# Altium project _1986BE4 Dev Board.PrjPCB
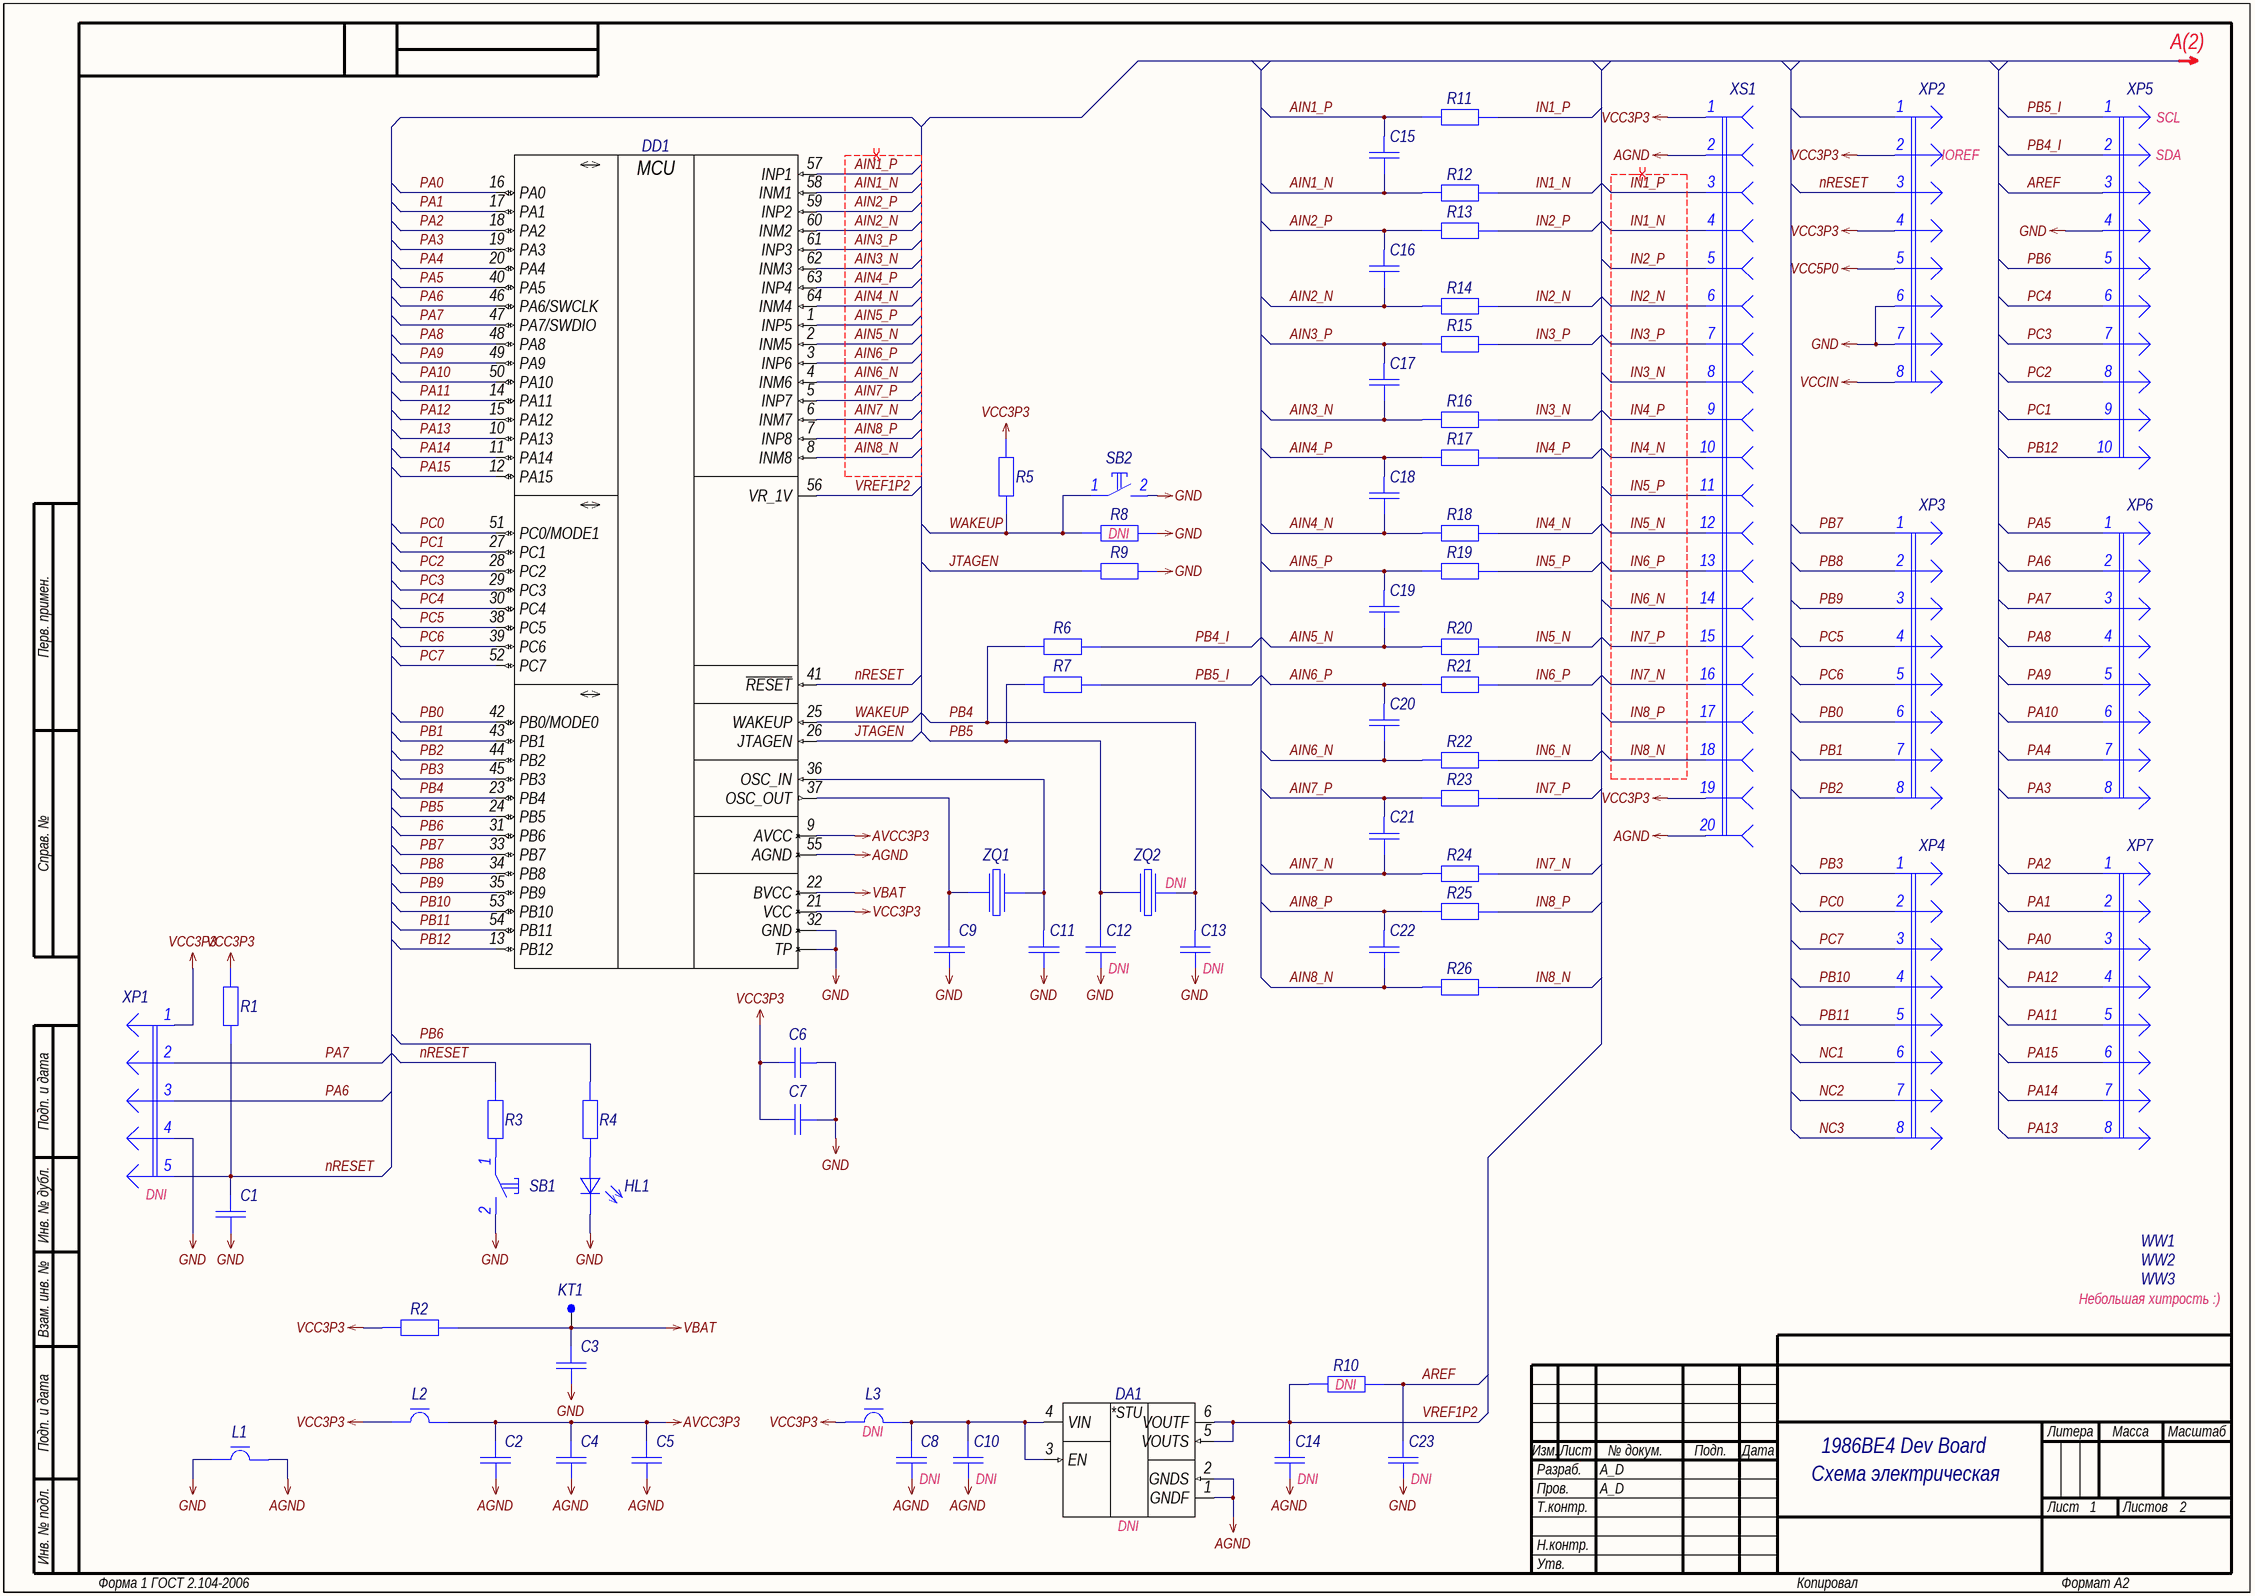
[diagram p0: 01_MAIN.SchDoc]
GlobalProjectRevision: 0; GlobalProjectNumber: A_D.000000.001; GlobalProjectName: 1986BE4 Dev Board; GlobalOrganizationName: A_D Electronics
2 sheets, 151 parts. Net scope: global (net labels, ports and power ports of the same name join across sheets).
Board file: BOARD.PcbDoc
Sheets:
  01_MAIN.SchDoc
  02_POWER.SchDoc

## Sheet 01_MAIN.SchDoc: =GlobalProjectName
size 594 x 420 mm; CheckedBy: A_D; Author: A_D; Organization: A_D Electronics; DocumentNumber: A_D.000000.001 Э3; Revision: 0; SheetNumber: 1; SheetTotal: 2; PageSetup: Record=PageOptions|CenterHorizontal=True|CenterVertical=True|PrintScale=0.70|XCorrection=1.00|YCorrection=1.00|PrintKind=2|BorderSize=5000000|LeftOffset=9000|BottomOffset=10100|Orientation=2|PaperLength=11176|PaperWidth=8636|Scale=100|PaperSource=259|PrintQuality=-3|MediaType=1|DitherType=10|PrintScaleMode=1|PaperKind=A3|PaperIndex=8; FirstApplication: A_D.000000.001; DocumentName: 1986BE4 Dev Board

### Parts
C1  Capacitor  [C0603_L]  (value not drawn)
C2  Capacitor  [C0603_L]  (value not drawn)
C3  Capacitor  [C0603_L]  (value not drawn)
C4  Capacitor  [C0603_L]  (value not drawn)
C5  Capacitor  [C0603_L]  (value not drawn)
C6  Capacitor  [C0603_L]  (value not drawn)
C7  Capacitor  [C0603_L]  (value not drawn)
C8  Capacitor  [C0603_L]  (value not drawn)  (no BOM)
C9  Capacitor  [C0603_L]  (value not drawn)
C10  Capacitor  [C0603_L]  (value not drawn)  (no BOM)
C11  Capacitor  [C0603_L]  (value not drawn)
C12  Capacitor  [C0603_L]  (value not drawn)  (no BOM)
C13  Capacitor  [C0603_L]  (value not drawn)  (no BOM)
C14  Capacitor  [C0603_L]  (value not drawn)  (no BOM)
C15  Capacitor  [C0603_L]  (value not drawn)
C16  Capacitor  [C0603_L]  (value not drawn)
C17  Capacitor  [C0603_L]  (value not drawn)
C18  Capacitor  [C0603_L]  (value not drawn)
C19  Capacitor  [C0603_L]  (value not drawn)
C20  Capacitor  [C0603_L]  (value not drawn)
C21  Capacitor  [C0603_L]  (value not drawn)
C22  Capacitor  [C0603_L]  (value not drawn)
C23  Capacitor  [C0603_L]  (value not drawn)  (no BOM)
DA1  ADR34xx-Series  [TSOT-23-6_095P290X160X100_N]  (value not drawn)  (no BOM)
DD1  1986ВЕ4У1-Series  [5153.64-1]  (value not drawn)
HL1  TEST  [LD0603_L]  (value not drawn)
KT1  VBAT  [TP-SMT-C-0.8mm]  (value not drawn)  (no BOM)
L1  FerriteBead  [L0805_L]  (value not drawn)
L2  FerriteBead  [L0603_L]  (value not drawn)
L3  FerriteBead  [L0603_L]  (value not drawn)  (no BOM)
R1  Resistor  [R0603_L]  (value not drawn)
R2  Resistor  [R0603_L]  (value not drawn)
R3  Resistor  [R0603_L]  (value not drawn)
R4  Resistor  [R0603_L]  (value not drawn)
R5  Resistor  [R0603_L]  (value not drawn)
R6  Resistor  [R0603_L]  (value not drawn)
R7  Resistor  [R0603_L]  (value not drawn)
R8  Resistor  [R0603_L]  (value not drawn)  (no BOM)
R9  Resistor  [R0603_L]  (value not drawn)
R10  Resistor  [R0603_L]  (value not drawn)  (no BOM)
R11  Resistor  [R0603_L]  (value not drawn)
R12  Resistor  [R0603_L]  (value not drawn)
R13  Resistor  [R0603_L]  (value not drawn)
R14  Resistor  [R0603_L]  (value not drawn)
R15  Resistor  [R0603_L]  (value not drawn)
R16  Resistor  [R0603_L]  (value not drawn)
R17  Resistor  [R0603_L]  (value not drawn)
R18  Resistor  [R0603_L]  (value not drawn)
R19  Resistor  [R0603_L]  (value not drawn)
R20  Resistor  [R0603_L]  (value not drawn)
R21  Resistor  [R0603_L]  (value not drawn)
R22  Resistor  [R0603_L]  (value not drawn)
R23  Resistor  [R0603_L]  (value not drawn)
R24  Resistor  [R0603_L]  (value not drawn)
R25  Resistor  [R0603_L]  (value not drawn)
R26  Resistor  [R0603_L]  (value not drawn)
SB1  СБРОС  [IT-1185AP]  (value not drawn)
SB2  WAKEUP  [IT-1185AP]  (value not drawn)
WW1  NoBody  [Mark-Fiducial_2.00mm]  (value not drawn)  (no BOM)
WW2  NoBody  [Mark-Fiducial_2.00mm]  (value not drawn)  (no BOM)
WW3  NoBody  [Mark-Fiducial_2.00mm]  (value not drawn)  (no BOM)
XP1  Prog  [PLS-5]  (value not drawn)  (no BOM)
XP2  Text  [PLS-8]  (value not drawn)
XP3  Text  [PLS-8]  (value not drawn)
XP4  Text  [PLS-8]  (value not drawn)
XP5  Text  [PLS-10]  (value not drawn)
XP6  Text  [PLS-8]  (value not drawn)
XP7  Text  [PLS-8]  (value not drawn)
XS1  ADC  [PBD-20]  (value not drawn)
ZQ1  Crystal  [SMD 5x3.2mm]  (value not drawn)
ZQ2  Crystal-1_4p  [DSO-N4]  (value not drawn)  (no BOM)

### Nets
AGND: C2.1 C4.1 C5.1 C8.1 C10.1 C14.1 DA1.1(GNDF) DA1.2(GNDS) DD1.55(AGND) L1.2 XS1.2 XS1.20
AVCC3P3: C2.2 C4.2 C5.2 DD1.9(AVCC) L2.2
GND: C1.1 C3.1 C6.1 C7.1 C9.1 C11.1 C12.1 C13.1 C23.1 DD1.32(GND) DD1.TP HL1.2(К) L1.1 R8.2 R9.2 SB1.2 SB2.2 XP1.4 XP2.6 XP2.7 XP5.4
VBAT: C3.2 DD1.22(BVCC) KT1.1 R2.2
VCC3P3: C6.2 C7.2 DD1.21(VCC) L2.1 L3.1 R1.2 R2.1 R5.2 XP1.1 XP2.2 XP2.4 XS1.1 XS1.19
VCC5P0: XP2.5
VCCIN: XP2.8
AIN1_N: C15.1 DD1.58(INM1) R12.1
AIN1_P: C15.2 DD1.57(INP1) R11.1
AIN2_N: C16.1 DD1.60(INM2) R14.1
AIN2_P: C16.2 DD1.59(INP2) R13.1
AIN3_N: C17.1 DD1.62(INM3) R16.1
AIN3_P: C17.2 DD1.61(INP3) R15.1
AIN4_N: C18.1 DD1.64(INM4) R18.1
AIN4_P: C18.2 DD1.63(INP4) R17.1
AIN5_N: C19.1 DD1.2(INM5) R20.1
AIN5_P: C19.2 DD1.1(INP5) R19.1
AIN6_N: C20.1 DD1.4(INM6) R22.1
AIN6_P: C20.2 DD1.3(INP6) R21.1
AIN7_N: C21.1 DD1.6(INM7) R24.1
AIN7_P: C21.2 DD1.5(INP7) R23.1
AIN8_N: C22.1 DD1.8(INM8) R26.1
AIN8_P: C22.2 DD1.7(INP8) R25.1
AREF: C23.2 R10.2 XP5.3
IN1_N: R12.2 XS1.4
IN1_P: R11.2 XS1.3
IN2_N: R14.2 XS1.6
IN2_P: R13.2 XS1.5
IN3_N: R16.2 XS1.8
IN3_P: R15.2 XS1.7
IN4_N: R18.2 XS1.10
IN4_P: R17.2 XS1.9
IN5_N: R20.2 XS1.12
IN5_P: R19.2 XS1.11
IN6_N: R22.2 XS1.14
IN6_P: R21.2 XS1.13
IN7_N: R24.2 XS1.16
IN7_P: R23.2 XS1.15
IN8_N: R26.2 XS1.18
IN8_P: R25.2 XS1.17
JTAGEN: DD1.26(JTAGEN) R9.1
NC1: XP4.6
NC2: XP4.7
NC3: XP4.8
nRESET: C1.2 DD1.41(~{RESET}) R1.1 R3.2 XP1.5 XP2.3
PA0: DD1.16(PA0) XP7.3
PA1: DD1.17(PA1) XP7.2
PA2: DD1.18(PA2) XP7.1
PA3: DD1.19(PA3) XP6.8
PA4: DD1.20(PA4) XP6.7
PA5: DD1.40(PA5) XP6.1
PA6: DD1.46(PA6/SWCLK) XP1.3 XP6.2
PA7: DD1.47(PA7/SWDIO) XP1.2 XP6.3
PA8: DD1.48(PA8) XP6.4
PA9: DD1.49(PA9) XP6.5
PA10: DD1.50(PA10) XP6.6
PA11: DD1.14(PA11) XP7.5
PA12: DD1.15(PA12) XP7.4
PA13: DD1.10(PA13) XP7.8
PA14: DD1.11(PA14) XP7.7
PA15: DD1.12(PA15) XP7.6
PB0: DD1.42(PB0/MODE0) XP3.6
PB1: DD1.43(PB1) XP3.7
PB2: DD1.44(PB2) XP3.8
PB3: DD1.45(PB3) XP4.1
PB4: C13.2 DD1.23(PB4) R6.1 ZQ2.1
PB4_I: R6.2 XP5.2
PB5: C12.2 DD1.24(PB5) R7.1 ZQ2.4
PB5_I: R7.2 XP5.1
PB6: DD1.31(PB6) R4.2 XP5.5
PB7: DD1.33(PB7) XP3.1
PB8: DD1.34(PB8) XP3.2
PB9: DD1.35(PB9) XP3.3
PB10: DD1.53(PB10) XP4.4
PB11: DD1.54(PB11) XP4.5
PB12: DD1.13(PB12) XP5.10
PC0: DD1.51(PC0/MODE1) XP4.2
PC1: DD1.27(PC1) XP5.9
PC2: DD1.28(PC2) XP5.8
PC3: DD1.29(PC3) XP5.7
PC4: DD1.30(PC4) XP5.6
PC5: DD1.38(PC5) XP3.4
PC6: DD1.39(PC6) XP3.5
PC7: DD1.52(PC7) XP4.3
VREF1P2: C14.2 DA1.5(VOUTS) DA1.6(VOUTF) DD1.56(VR_1V) R10.1
WAKEUP: DD1.25(WAKEUP) R5.1 R8.1 SB2.1
NetC8_2: C8.2 C10.2 DA1.3(EN) DA1.4(VIN) L3.2
NetC9_2: C9.2 DD1.37(OSC_OUT) ZQ1.1
NetC11_2: C11.2 DD1.36(OSC_IN) ZQ1.3
NetHL1_1: HL1.1(А) R4.1
NetR3_1: R3.1 SB1.1

Not connected (* = marked no-connect by the designer): XP2 1

### Layout directives
differential pair: AIN1_N, AIN1_P, AIN2_N, AIN2_P, AIN3_N, AIN3_P, AIN4_N, AIN4_P, AIN5_N, AIN5_P, AIN6_N, AIN6_P, AIN7_N, AIN7_P, AIN8_N, AIN8_P, IN1_N, IN1_P, IN2_N, IN2_P, IN3_N, IN3_P, IN4_N, IN4_P, IN5_N, IN5_P, IN6_N, IN6_P, IN7_N, IN7_P, IN8_N, IN8_P

### Notes on the sheet
- А(2)
- (near XP5) SCL
- (near XP2) IOREF
- (near XP5) SDA
- (near R8) DNI
- (near ZQ2) DNI
- (near C12) DNI
- (near C13) DNI
- (near XP1) DNI
- (near WW3) Небольшая хитрость :)
- (near R10) DNI
- (near L3) DNI
- (near C8) DNI
- (near C10) DNI
- (near C14) DNI
- (near C23) DNI
- Схема электрическая
  принципиальная
- (near DA1) DNI
- Перв. примен.
- Справ. №
- Подп. и дата
- Инв. № дубл.
- Взам. инв. №
- Разраб.
- Изм.
- Лист
- № докум.
- Подп.
- Дата
- Литера
- Масса
- Масштаб
- Пров.
- Т.контр.
- Листов
- Инв. № подл.
- Н.контр.
- Утв.
- Форма 1 ГОСТ 2.104-2006
- Копировал
- Формат А2
- (in symbol ADR3412ARJZ-R7) *STU
- (in symbol К1986ВЕ4У1К) MCU

### Library data of the parts
C1 C3 C4 C6 C10 C14 C23 = GRM188R72A104KA35D: Manufacturer: Murata; Type: Конденсатор; ID: 232; Value: 0.1uF; Voltage: 100V; Tolerance: ±10%; Dielectric Type: X7R; Application Category: 1; Working Temperature Min: -55°С; Working Temperature Max: +125°С; Published: 18.05.2010; Publisher: Andrew Danich; Part Number: GRM188R72A104KA35D; Footprint: 0603
C2 = GRM188R60J106ME47D: Manufacturer: Murata; Type: Конденсатор; ID: 136; Value: 10uF; Voltage: 6.3V; Tolerance: ±20%; Dielectric Type: X5R; Application Category: 1; Working Temperature Min: -55°С; Working Temperature Max: +85°С; Published: 18.05.2010; Publisher: Andrew Danich; Part Number: GRM188R60J106ME47D; Footprint: 0603
C5 = GCJ188R72A103KA01D: Manufacturer: Murata; Type: Конденсатор; ID: 130; Value: 0.01uF; Voltage: 100V; Tolerance: ±10%; Dielectric Type: X7R; Application Category: 1; Working Temperature Min: -55°С; Working Temperature Max: +125°С; Published: 18.05.2010; Publisher: Andrew Danich; Part Number: GCJ188R72A103KA01D; Footprint: 0603
C7 C8 = GCM188R71E105KA64D: Manufacturer: Murata; Type: Конденсатор; ID: 134; Value: 1uF; Voltage: 25V; Tolerance: ±10%; Dielectric Type: X7R; Application Category: 1; Working Temperature Min: -55°С; Working Temperature Max: +85°С; Published: 18.05.2010; Publisher: Andrew Danich; Part Number: GCM188R71E105KA64D; Footprint: 0603
C9 C11-C13 = GCM1885C2A120JA16D: Manufacturer: Murata; Type: Конденсатор; ID: 121; Value: 12pF; Voltage: 100V; Tolerance: ±5%; Dielectric Type: NP0; Application Category: 1; Working Temperature Min: -55°С; Working Temperature Max: +125°С; Published: 18.05.2010; Publisher: Andrew Danich; Part Number: GCM1885C2A120JA16D; Footprint: 0603
C15-C22 = GCM1885C2A101JA16D: Manufacturer: Murata; Type: Конденсатор; ID: 155; Value: 100pF; Voltage: 100V; Tolerance: ±5%; Dielectric Type: NP0; Application Category: 1; Working Temperature Min: -55°С; Working Temperature Max: +125°С; Published: 18.05.2010; Publisher: Andrew Danich; Part Number: GCM1885C2A101JA16D; Footprint: 0603
DA1 = ADR3412ARJZ-R7: Manufacturer: Analog Devices; ID: 18; Input Voltage: +2.3…5.5V; Output Current: 10mA; Output Voltage: +1.2V; Temperature Coefficient: 8ppm; Supply Current: 85uA; Application Category: 1; Working Temperature Min: -40°С; Working Temperature Max: +125°С; Functional Analog: ADR3412ARJZ-R2; Published: 01.10.2018; Publisher: Andrew Danich; Type: Микросхема; Part Number: ADR3412ARJZ-R7; Value: ADR3412ARJZ-R7
DD1 = К1986ВЕ4У1К: Manufacturer: Миландр; ID: 1; Supply Operation: +2.2…3.6V; Flash: 128Kb; SRAM: 16Kb; Prog Interface: SWD, JTAG; I/O Lines: 36; Operation Frequency: 36MHz; Specification: АЕЯР.431280.912 ТУ; Working Temperature Min: 0°С; Working Temperature Max: +70°С; Functional Analog: К1986ВЕ4У1, 1986ВЕ4У1; Published: 24.08.2018; Publisher: Andrew Danich; Type: Микросхема; Part Number: К1986ВЕ4У1К; Value: К1986ВЕ4У1К; EEPROM: -; Application Category: 1
HL1 = BL-LS0603DNB: Type: Индикатор единичный; ID: 12; Forward Voltage: 3.5V; Forward Current: 30mA; Power Dissipation: 78mW; Color: Blue; Leds: 1; Published: 03.12.2013; Publisher: Andrew Danich; Part Number: BL-LS0603DNB; Value: BL-LS0603DNB; Footprint: 0603; Application Category: 1
KT1 = TestPoint-SMT: ID: 6; Application Type: On PCB Test Point; Application Category: 1; Published: 03.03.2015; Publisher: Andrew Danich; Part Number: TestPoint-SMT; Value: TestPoint-SMT; Manufacturer: -; Functional Analog: -
L1 = BLM21PG331SN1: Manufacturer: Murata; Type: Дроссель; ID: 2; Rated Current: 1.5A; Impedance at 100Mhz: 330ohm; Tolerance: ±25%; DC Resistance: 0.07ohm; Inductor Type: EMIFIL; Application Category: 1; Working Temperature Min: -55°С; Working Temperature Max: +125°С; Published: 14.11.2014; Publisher: Andrew Danich; Part Number: BLM21PG331SN1; Value: BLM21PG331SN1; Footprint: 0805; ClassName: PolyDirectConnect
L2 L3 = BLM18PG331SN1: Manufacturer: Murata; Type: Дроссель; ID: 1; Rated Current: 1.2A; Impedance at 100Mhz: 330ohm; Tolerance: ±25%; DC Resistance: 0.15ohm; Inductor Type: EMIFIL; Working Temperature Min: -55°С; Working Temperature Max: +125°С; Published: 14.11.2014; Publisher: Andrew Danich; Part Number: BLM18PG331SN1; Value: BLM18PG331SN1; Footprint: 0603; Application Category: 1
R1 R5 = RC0603JR-0710KL: Manufacturer: Yageo; ID: 12; Value: 10k; Limit Voltage: 50V; Tolerance: ±5%; Temperature Coefficient: 100ppm; Total Power Dissipation: 0.1W; Series Type: Thick-Film; Application Category: 1; Working Temperature Min: -55°С; Working Temperature Max: +155°С; Functional Analog: CR0603-JW-103E; Published: 24.03.2010; Publisher: Andrew Danich; Type: Резистор; Part Number: RC0603JR-0710KL; Footprint: 0603
R2 R6-R10 = RC0603JR-070R: Manufacturer: Yageo; ID: 5; Value: 0; Limit Voltage: 50V; Tolerance: ±5%; Temperature Coefficient: 100ppm; Total Power Dissipation: 0.1W; Series Type: Thick-Film; Application Category: 1; Working Temperature Min: -55°С; Working Temperature Max: +155°С; Functional Analog: RC0603FR-070RL, CR0603-J/-000E; Published: 24.03.2010; Publisher: Andrew Danich; Type: Резистор; Part Number: RC0603JR-070R; Footprint: 0603
R3 = RC0603JR-07100R: Manufacturer: Yageo; ID: 10; Value: 100; Limit Voltage: 50V; Tolerance: ±5%; Temperature Coefficient: 100ppm; Total Power Dissipation: 0.1W; Series Type: Thick-Film; Application Category: 1; Working Temperature Min: -55°С; Working Temperature Max: +155°С; Functional Analog: CR0603-JW-101E; Published: 24.03.2010; Publisher: Andrew Danich; Type: Резистор; Part Number: RC0603JR-07100R; Footprint: 0603
R4 = RC0603JR-07330RL: Manufacturer: Yageo; ID: 313; Value: 330; Limit Voltage: 50V; Tolerance: ±5%; Temperature Coefficient: 100ppm; Total Power Dissipation: 0.1W; Series Type: Thick-Film; Application Category: 1; Working Temperature Min: -55°С; Working Temperature Max: +155°С; Functional Analog: CR0603-JW-331E; Published: 24.03.2010; Publisher: Andrew Danich; Type: Резистор; Part Number: RC0603JR-07330RL; Footprint: 0603
R11-R26 = RC0603FR-0749R9L: Manufacturer: Yageo; ID: 249; Value: 49.9; Limit Voltage: 50V; Tolerance: ±1%; Temperature Coefficient: 100ppm; Total Power Dissipation: 0.1W; Series Type: Thick-Film; Application Category: 1; Working Temperature Min: -55°С; Working Temperature Max: +155°С; Functional Analog: CR0603-FX-49R9E; Published: 24.03.2010; Publisher: Andrew Danich; Type: Резистор; Part Number: RC0603FR-0749R9L; Footprint: 0603
SB1 SB2 = IT-1185AP: ID: 36; Limit Current: 50mA; Resistance: 0.1ohm; Isolator Resistance: 100meg; Backlight: NO; Number of Contacts: 2; Application Category: 1; Published: 17.04.2014; Publisher: Andrew Danich; Type: Переключатель; Part Number: IT-1185AP; Value: IT-1185AP; Height: 5mm
WW1-WW3 = MARK_FIDUCIAL: ID: 3; Published: 24.03.2015; Publisher: Andrew Danich; Type: Лепесток; Part Number: MARK_FIDUCIAL; Value: MARK_FIDUCIAL
XP1 = PLS-5: Value: PLS-5; ID: 4; Limit Voltage: 250V; Limit Current: 3A; Connector Type: Male; Resistance: 15momh; Surface Finish: Gold; Pitch: 2.54mm; Application Category: 1; Published: 07.03.2013; Publisher: Andrew Danich; Type: Вилка; Part Number: PLS-5; Pins: 5
XP2-XP4 XP6 XP7 = PLS-8: Value: PLS-8; ID: 7; Limit Voltage: 250V; Limit Current: 3A; Connector Type: Male; Resistance: 15momh; Surface Finish: Gold; Pitch: 2.54mm; Application Category: 1; Published: 07.03.2013; Publisher: Andrew Danich; Type: Вилка; Part Number: PLS-8; Pins: 8
XP5 = PLS-10: Value: PLS-10; ID: 9; Limit Voltage: 250V; Limit Current: 3A; Connector Type: Male; Resistance: 15momh; Surface Finish: Gold; Pitch: 2.54mm; Application Category: 1; Published: 07.03.2013; Publisher: Andrew Danich; Type: Вилка; Part Number: PLS-10; Pins: 10
XS1 = PBD-20: Value: PBD-20; ID: 24; Limit Voltage: 250V; Limit Current: 3A; Connector Type: Female; Resistance: 15momh; Surface Finish: Gold; Pitch: 2.54mm; Application Category: 1; Published: 07.03.2013; Publisher: Andrew Danich; Type: Розетка; Part Number: PBD-20; Pins: 20
ZQ1 = AB-16.000MAGE-T: ID: 13; Output Frequency: 16MHz; Load Capacitance: 12pF; Application Category: 1; Published: 08.03.2013; Publisher: Andrew Danich; Type: Резонатор; Part Number: AB-16.000MAGE-T; Value: AB-16.000MAGE-T
ZQ2 = MC306-32.768KHz: Manufacturer: Seiko Epson Corporation; ID: 11; Shunt Capacitance: 0.9pF; Load Capacitance: 12.5pF; Application Category: 1; Working Temperature Min: -40°С; Working Temperature Max: +85°С; Published: 12.09.2014; Publisher: Andrew Danich; Type: Резонатор; Part Number: MC306-32.768KHz; Value: MC306-32.768KHz; Output Frequency: 32.768KHz; Functional Analog: -

## Sheet 02_POWER.SchDoc: =GlobalProjectName
size 594 x 420 mm; CheckedBy: A_D; Author: A_D; Organization: A_D Electronics; DocumentNumber: A_D.000000.001 Э3; Revision: 0; SheetNumber: 2; SheetTotal: 2; PageSetup: Record=PageOptions|CenterHorizontal=True|CenterVertical=True|PrintScale=0.70|XCorrection=1.00|YCorrection=1.00|PrintKind=2|BorderSize=5000000|LeftOffset=9000|BottomOffset=10100|Orientation=2|PaperLength=11176|PaperWidth=8636|Scale=100|PaperSource=259|PrintQuality=-3|MediaType=1|DitherType=10|PrintScaleMode=1|PaperKind=A3|PaperIndex=8; FirstApplication: A_D.000000.001; DocumentName: 1986BE4 Dev Board
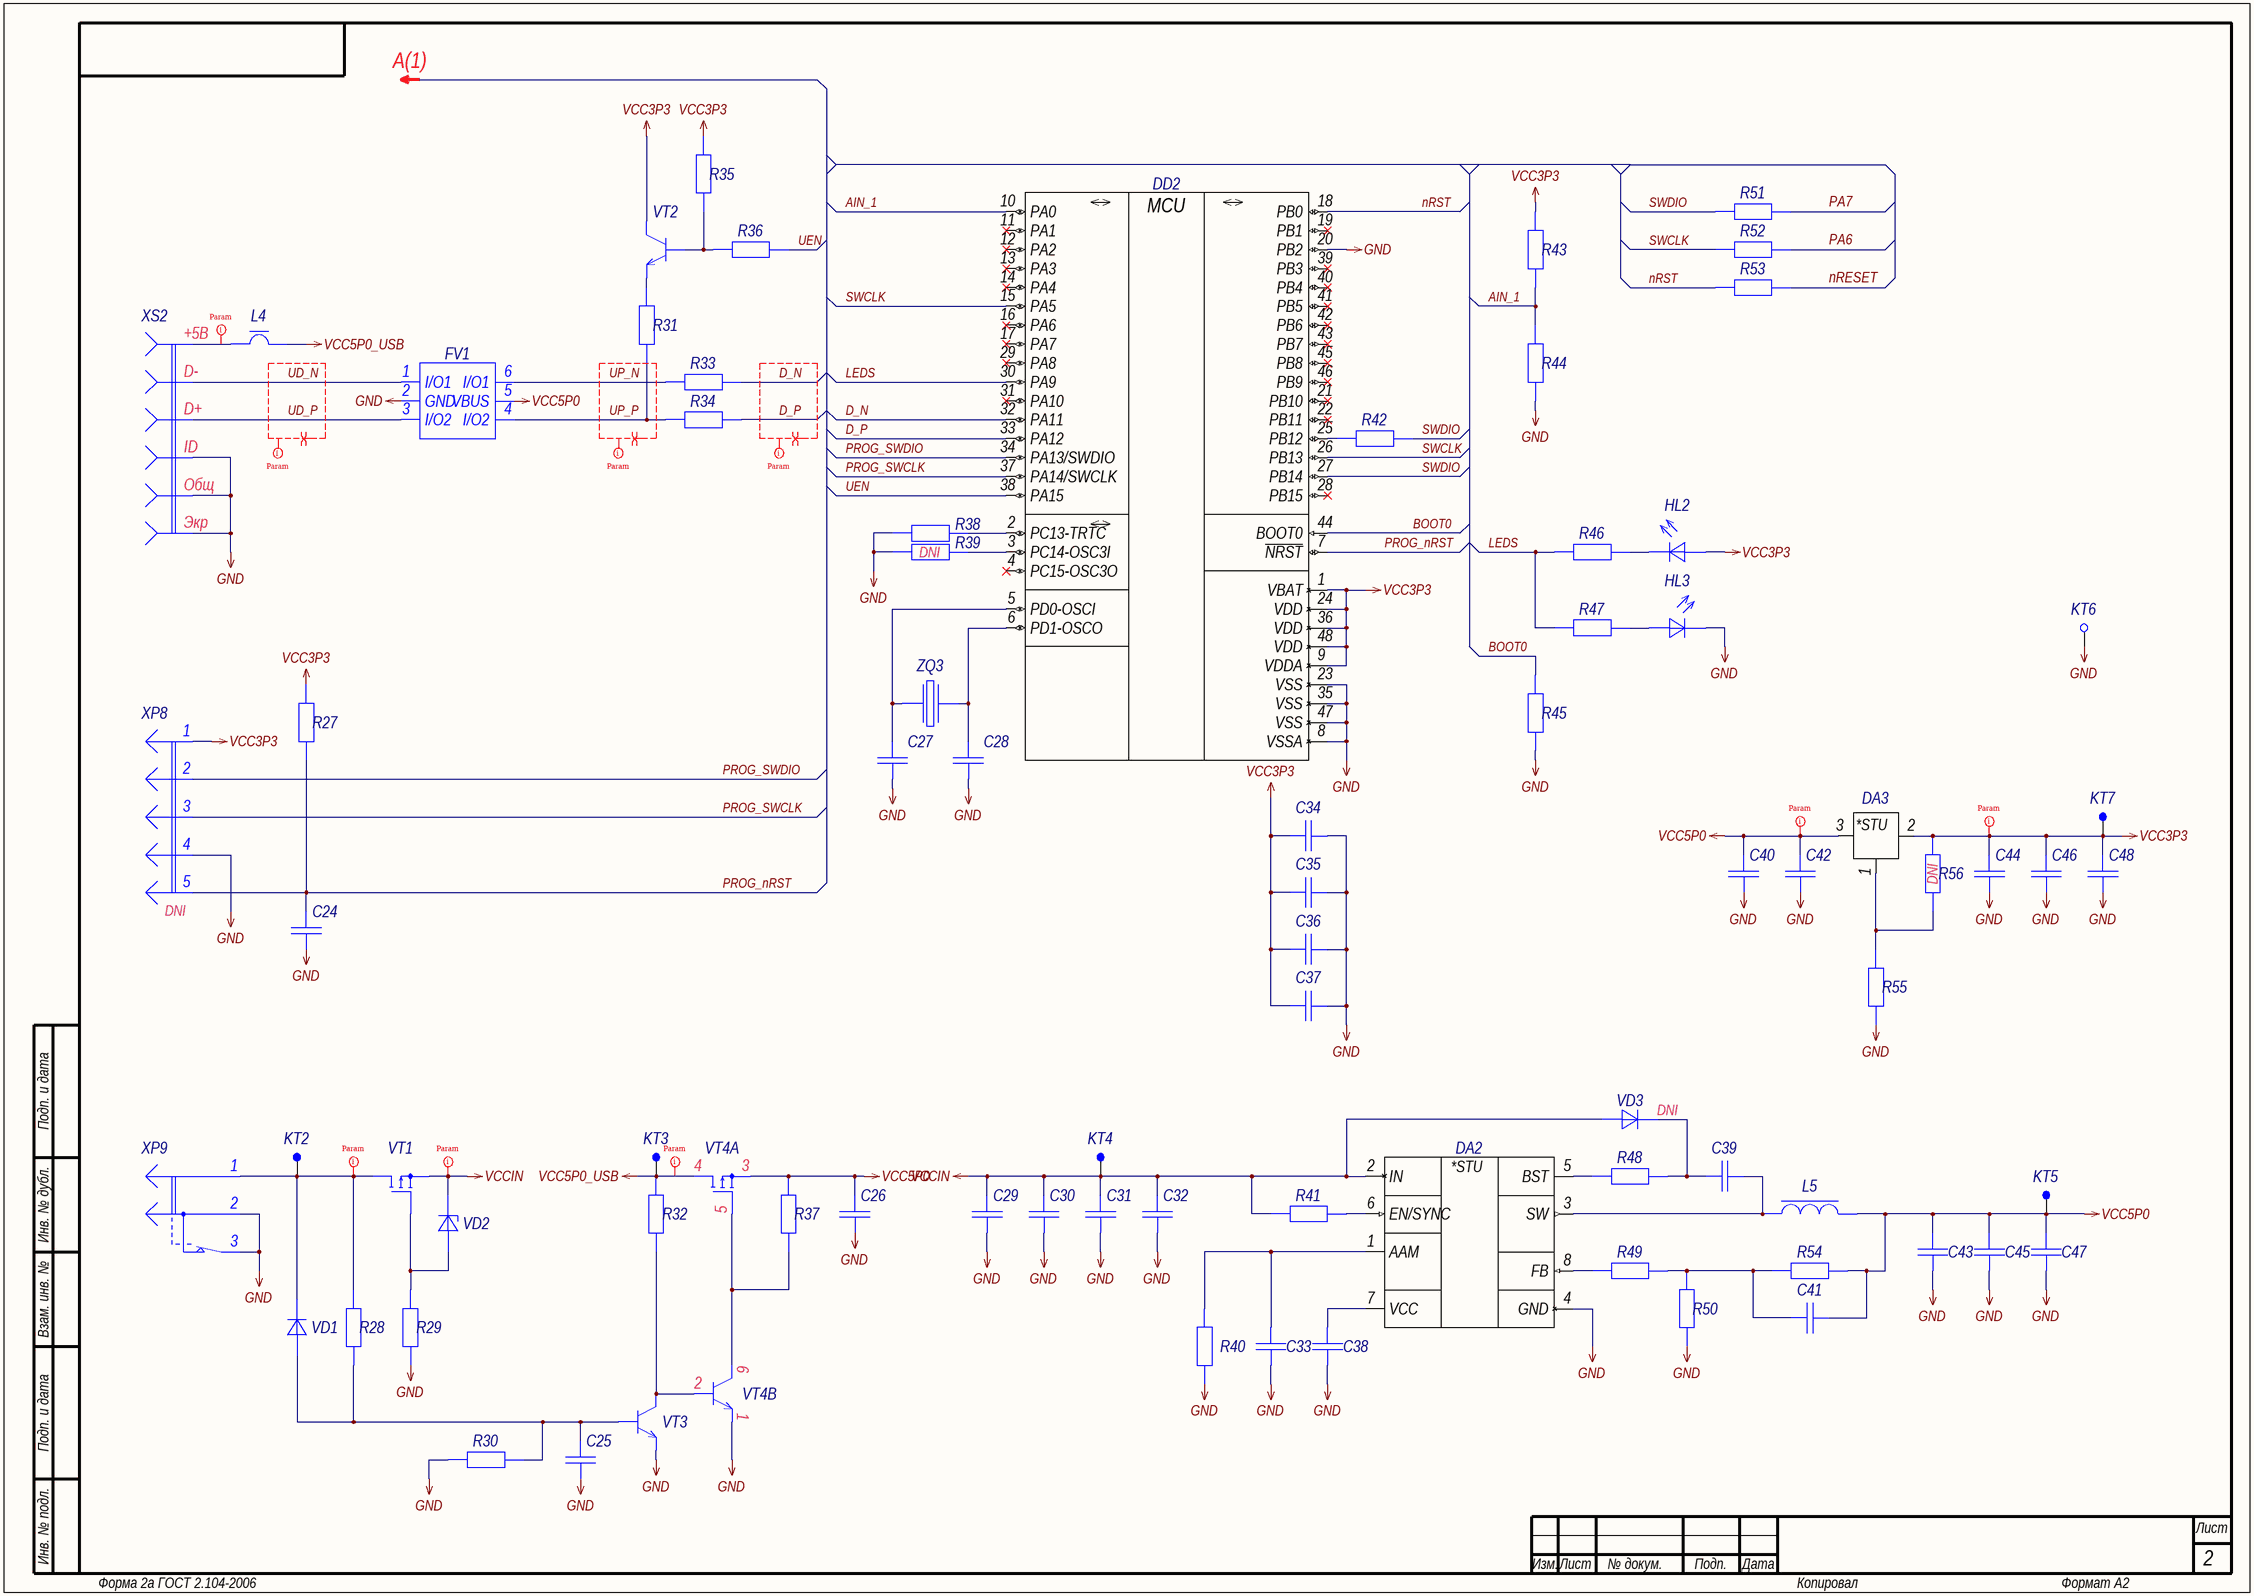
[diagram p1: 02_POWER.SchDoc]

### Parts
C24  Capacitor  [C0603_L]  (value not drawn)
C25  Capacitor  [C0603_L]  (value not drawn)
C26  Capacitor  [C0805_L]  (value not drawn)
C27  Capacitor  [C0603_L]  (value not drawn)
C28  Capacitor  [C0603_L]  (value not drawn)
C29  Capacitor  [C1206_L]  (value not drawn)
C30  Capacitor  [C1206_L]  (value not drawn)
C31  Capacitor  [C1206_L]  (value not drawn)
C32  Capacitor  [C0603_L]  (value not drawn)
C33  Capacitor  [C0603_L]  (value not drawn)
C34  Capacitor  [C0603_L]  (value not drawn)
C35  Capacitor  [C0603_L]  (value not drawn)
C36  Capacitor  [C0603_L]  (value not drawn)
C37  Capacitor  [C0603_L]  (value not drawn)
C38  Capacitor  [C0603_L]  (value not drawn)
C39  Capacitor  [C0603_L]  (value not drawn)
C40  Capacitor  [C0805_L]  (value not drawn)
C41  Capacitor  [C0603_L]  (value not drawn)
C42  Capacitor  [C0603_L]  (value not drawn)
C43  Capacitor  [C0805_L]  (value not drawn)
C44  Capacitor  [C0603_L]  (value not drawn)
C45  Capacitor  [C0805_L]  (value not drawn)
C46  Capacitor  [C0805_L]  (value not drawn)
C47  Capacitor  [C0805_L]  (value not drawn)
C48  Capacitor  [C0805_L]  (value not drawn)
DA2  MP2315GJ  [TSOT-23-8_065P290X160X100_N]  (value not drawn)
DA3  LM1117-Series  [SOT-223_230P650X350X180_N]  (value not drawn)
DD2  STM32F103Cxxx-Series  [LQFP-48_050P700X700X160_N]  (value not drawn)
FV1  USBLC6-2SC6  [SOT-23-6_095P290X160X145_N]  (value not drawn)
HL2  Text  [LD0603_L]  (value not drawn)
HL3  Text  [LD0603_L]  (value not drawn)
KT2  VCCIN  [TP-SMT-C-0.8mm]  (value not drawn)  (no BOM)
KT3  VBUS  [TP-SMT-C-0.8mm]  (value not drawn)  (no BOM)
KT4  VCCIN  [TP-SMT-C-0.8mm]  (value not drawn)  (no BOM)
KT5  +5V  [TP-SMT-C-0.8mm]  (value not drawn)  (no BOM)
KT6  ОБЩ  [5001]  (value not drawn)  (no BOM)
KT7  +3.3V  [TP-SMT-C-0.8mm]  (value not drawn)  (no BOM)
L4  FerriteBead  [L0603_L]  (value not drawn)
L5  Coil  [SRP5030T-Series]  (value not drawn)
R27  Resistor  [R0603_L]  (value not drawn)
R28  Resistor  [R0603_L]  (value not drawn)
R29  Resistor  [R0603_L]  (value not drawn)
R30  Resistor  [R0603_L]  (value not drawn)
R31  Resistor  [R0603_L]  (value not drawn)
R32  Resistor  [R0603_L]  (value not drawn)
R33  Resistor  [R0603_L]  (value not drawn)
R34  Resistor  [R0603_L]  (value not drawn)
R35  Resistor  [R0603_L]  (value not drawn)
R36  Resistor  [R0603_L]  (value not drawn)
R37  Resistor  [R0603_L]  (value not drawn)
R38  Resistor  [R0603_L]  (value not drawn)
R39  Resistor  [R0603_L]  (value not drawn)  (no BOM)
R40  Resistor  [R0603_L]  (value not drawn)
R41  Resistor  [R0603_L]  (value not drawn)
R42  Resistor  [R0603_L]  (value not drawn)
R43  Resistor  [R0603_L]  (value not drawn)
R44  Resistor  [R0603_L]  (value not drawn)
R45  Resistor  [R0603_L]  (value not drawn)
R46  Resistor  [R0603_L]  (value not drawn)
R47  Resistor  [R0603_L]  (value not drawn)
R48  Resistor  [R0603_L]  (value not drawn)
R49  Resistor  [R0603_L]  (value not drawn)
R50  Resistor  [R0603_L]  (value not drawn)
R51  Resistor  [R0603_L]  (value not drawn)
R52  Resistor  [R0603_L]  (value not drawn)
R53  Resistor  [R0603_L]  (value not drawn)
R54  Resistor  [R0603_L]  (value not drawn)
R55  Resistor  [R0603_L]  (value not drawn)
R56  Resistor  [R0603_L]  (value not drawn)  (no BOM)
VD1  Diode  [SOD-323]  (value not drawn)
VD2  Zener  [SOD-323]  (value not drawn)
VD3  Diode  [SOD-323]  (value not drawn)  (no BOM)
VT1  MOSFET-P  [SOT-23_190P290X160X145_N]  (value not drawn)
VT2  BJT-NPN  [SOT-23_190P290X160X145_N]  (value not drawn)
VT3  BJT-NPN  [SOT-23_190P290X160X145_N]  (value not drawn)
VT4  PMC85XP  [SOT-1118-2M_065P200X200X065_N]  (value not drawn)  (parts A,B of 2)
XP8  Prog  [PLS-5]  (value not drawn)  (no BOM)
XP9  DC  [DJK-02-Series]  (value not drawn)
XS2  J-Link  [1981568-1]  (value not drawn)
ZQ3  Crystal  [SMD 5x3.2mm]  (value not drawn)

### Nets
GND: C24.1 C25.1 C26.1 C27.1 C28.1 C29.1 C30.1 C31.1 C32.1 C33.1 C34.1 C35.1 C36.1 C37.1 C38.1 C40.1 C42.1 C43.1 C44.1 C45.1 C46.1 C47.1 C48.1 DA2.4(GND) DD2.8(VSSA) DD2.20(PB2) DD2.23(VSS) DD2.35(VSS) DD2.47(VSS) FV1.2(GND) HL3.2(К) KT6.1 R29.1 R30.2 R38.2 R39.2 R40.1 R44.1 R45.1 R50.1 R55.1 VT3.3(Э) VT4.1(Э) XP8.4 XP9.2 XP9.3 XS2.4 XS2.5 XS2.6
VCC3P3: C34.2 C35.2 C36.2 C37.2 C44.2 C46.2 C48.2 DA3.2(Out) DD2.1(VBAT) DD2.9(VDDA) DD2.24(VDD) DD2.36(VDD) DD2.48(VDD) HL2.1(А) KT7.1 R27.2 R35.2 R43.2 R56.2 VT2.2(К) XP8.1
VCC5P0: C26.2 C40.2 C41.2 C42.2 C43.2 C45.2 C47.2 DA3.3(In) FV1.5(VBUS) KT5.1 L5.2 R37.2 R54.2 VT4.3(S)
VCC5P0_USB: KT3.1 L4.2 R32.2 VT4.4(D)
VCCIN: C29.2 C30.2 C31.2 C32.2 DA2.2(IN) KT4.1 R41.1 VD2.2(К) VD3.1(А) VT1.3(S)
AIN_1: DD2.10(PA0) R43.1 R44.2
BOOT0: DD2.44(BOOT0) R45.2
D_N: DD2.32(PA11) R33.2
D_P: DD2.33(PA12) R34.2
LEDS: DD2.30(PA9) R46.1 R47.1
nRESET: R53.2
nRST: DD2.18(PB0) R53.1
PA6: R52.2
PA7: R51.2
PROG_nRST: C24.2 DD2.7(~{NRST}) R27.1 XP8.5
PROG_SWCLK: DD2.37(PA14/SWCLK) XP8.3
PROG_SWDIO: DD2.34(PA13/SWDIO) XP8.2
SWCLK: DD2.15(PA5) DD2.26(PB13) R52.1
SWDIO: DD2.27(PB14) R42.2 R51.1
UD_N: FV1.1(I/O1) XS2.2
UD_P: FV1.3(I/O2) XS2.3
UEN: DD2.38(PA15) R36.2
UP_N: FV1.6(I/O1) R33.1
UP_P: FV1.4(I/O2) R31.1 R34.1
NetC25_2: C25.2 R28.1 R30.1 VD1.1(А) VT3.1(Б)
NetC27_2: C27.2 DD2.5(PD0-OSCI) ZQ3.3
NetC28_2: C28.2 DD2.6(PD1-OSCO) ZQ3.1
NetC33_2: C33.2 DA2.1(AAM) R40.2
NetC38_2: C38.2 DA2.7(VCC)
NetC39_1: C39.1 R48.2 VD3.2(К)
NetC39_2: C39.2 DA2.3(SW) L5.1
NetC41_1: C41.1 R49.2 R50.2 R54.1
NetDA2_5: DA2.5(BST) R48.1
NetDA2_6: DA2.6(EN/SYNC) R41.2
NetDA2_8: DA2.8(FB) R49.1
NetDA3_1: DA3.1(Adj/GND) R55.2 R56.1
NetDD2_2: DD2.2(PC13-TRTC) R38.1
NetDD2_3: DD2.3(PC14-OSC3I) R39.1
NetDD2_25: DD2.25(PB12) R42.1
NetHL2_2: HL2.2(К) R46.2
NetHL3_1: HL3.1(А) R47.2
NetKT2_1: KT2.1 R28.2 VD1.2(К) VT1.2(D) XP9.1
NetL4_1: L4.1 XS2.1
NetR29_2: R29.2 VD2.1(А) VT1.1(G)
NetR31_2: R31.2 VT2.3(Э)
NetR32_1: R32.1 VT3.2(К) VT4.2(Б)
NetR35_1: R35.1 R36.1 VT2.1(Б)
NetR37_1: R37.1 VT4.5(G) VT4.6(К)

Not connected (* = marked no-connect by the designer): DD2 4(PC15-OSC3O)* 11(PA1)* 12(PA2)* 13(PA3)* 14(PA4)* 16(PA6)* 17(PA7)* 19(PB1)* 21(PB10)* 22(PB11)* 28(PB15)* 29(PA8)* 31(PA10)* 39(PB3)* 40(PB4)* 41(PB5)* 42(PB6)* 43(PB7)* 45(PB8)* 46(PB9)*

### Layout directives
differential pair: D_N, D_P, UD_N, UD_P, UP_N, UP_P
rule Matched Net Lengths [Tolerance = 1mm]: D_N, D_P, UD_N, UD_P, UP_N, UP_P
rule Polygon Connect Style [Style - Direct Connect]: NetKT2_1, NetL4_1, VCC3P3, VCC5P0, VCC5P0_USB, VCCIN

### Notes on the sheet
- А(1)
- (near R39) DNI
- (near R56) DNI
- (near XP8) DNI
- (near VD3) DNI
- Подп. и дата
- Инв. № дубл.
- Взам. инв. №
- Инв. № подл.
- Изм.
- Лист
- № докум.
- Подп.
- Дата
- Форма 2а ГОСТ 2.104-2006
- Копировал
- Формат А2
- (in symbol 1981568-1) +5В; D-; D+; ID; Общ; Экр
- (in symbol LM1117MPX-3.3) *STU
- (in symbol MP2315GJ-Z) *STU
- (in symbol STM32F103C8T6) MCU

### Library data of the parts
C24 C25 C32 C34-C39 C42 C44 = GRM188R72A104KA35D: as C1 on sheet 01_MAIN; Published: 18.05.2010; Publisher: Andrew Danich; Part Number: GRM188R72A104KA35D; Footprint: 0603
  C32 C39: ClassName: PolyDirectConnect
C26 C40 C43 C45-C48 = GRM21BR60J226ME39L: Manufacturer: Murata; Type: Конденсатор; ID: 140; Value: 22uF; Voltage: 6.3V; Tolerance: ±20%; Dielectric Type: X5R; Application Category: 1; Working Temperature Min: -55°С; Working Temperature Max: +85°С; Published: 18.05.2010; Publisher: Andrew Danich; Part Number: GRM21BR60J226ME39L; Footprint: 0805; ClassName: PolyDirectConnect
C27 C28 = GCM1885C1H150JA16D: Manufacturer: Murata; Type: Конденсатор; ID: 214; Value: 15pF; Voltage: 50V; Tolerance: ±5%; Dielectric Type: NP0; Application Category: 1; Working Temperature Min: -55°С; Working Temperature Max: +125°С; Published: 18.05.2010; Publisher: Andrew Danich; Part Number: GCM1885C1H150JA16D; Footprint: 0603
C29-C31 = GRM31CR71A226KE15L: Manufacturer: Murata; Type: Конденсатор; ID: 238; Value: 22uF; Voltage: 10V; Tolerance: ±10%; Dielectric Type: X7R; Application Category: 1; Working Temperature Min: -55°С; Working Temperature Max: +125°С; Published: 18.05.2010; Publisher: Andrew Danich; Part Number: GRM31CR71A226KE15L; Footprint: 1206; ClassName: PolyDirectConnect
C33 = GRM1885C2A102JA01D: Manufacturer: Murata; Type: Конденсатор; ID: 135; Value: 1000pF; Voltage: 100V; Tolerance: ±5%; Dielectric Type: NP0; Application Category: 1; Working Temperature Min: -55°С; Working Temperature Max: +125°С; Published: 18.05.2010; Publisher: Andrew Danich; Part Number: GRM1885C2A102JA01D; Footprint: 0603
C41 = GRM1885C1H330JA01D: Manufacturer: Murata; Type: Конденсатор; ID: 123; Value: 33pF; Voltage: 50V; Tolerance: ±5%; Dielectric Type: NP0; Application Category: 1; Working Temperature Min: -55°С; Working Temperature Max: +125°С; Published: 18.05.2010; Publisher: Andrew Danich; Part Number: GRM1885C1H330JA01D; Footprint: 0603
DA2 = MP2315GJ-Z: Manufacturer: Monolithic Power Systems; ID: 38; Input Voltage: +4.5…24V; Output Current: 3A; Output Voltage: +0.8…22.8V; Shutdown Input: YES; Frequency: 500kHz; Application Category: 1; Working Temperature Min: -40°С; Working Temperature Max: +125°С; Functional Analog: MP2315GJ-P; Type: Микросхема; Published: 01.09.2018; Publisher: Andrew Danich; Part Number: MP2315GJ-Z; Value: MP2315GJ-Z; ClassName: PolyDirectConnect
DA3 = LM1117MPX-3.3: ID: 9; Input Voltage: +8.5…20V; Output Current: 800mA; Output Voltage: +3.3V; Application Category: 1; Published: 13.08.2015; Publisher: Andrew Danich; Type: Микросхема; Part Number: LM1117MPX-3.3; Value: LM1117MPX-3.3; ClassName: PolyDirectConnect
DD2 = STM32F103C8T6: Manufacturer: STMicroelectronics; ID: 20; Supply Operation: +2.0…3.6V; Flash: 64K; SRAM: 20K; Prog Interface: JTAG, SWD, UART; I/O Lines: 37; Operation Frequency: 72MHz; Application Category: 1; Working Temperature Min: -40°С; Working Temperature Max: +85°С; Published: 16.10.2015; Publisher: Andrew Danich; Type: Микросхема; Part Number: STM32F103C8T6; Value: STM32F103C8T6; EEPROM: -
FV1 = USBLC6-2SC6: Manufacturer: STMicroelectronics; ID: 11; Breakdown Voltage: 6V; Reverse Stand Off Voltage: 17V; Forward Voltage: 0.95V; Peak Forward Current: 5A; Junction Capacitance: 2.5pF; Directional: Bidirectional; Application Category: 1; Working Temperature Min: -40°С; Working Temperature Max: +125°С; Published: 21.02.2017; Publisher: Andrew Danich; Type: Супрессор; Part Number: USBLC6-2SC6; Value: USBLC6-2SC6; Functional Analog: -
HL2 = BL-LS0603GC: Type: Индикатор единичный; ID: 14; Forward Voltage: 2.3V; Forward Current: 30mA; Power Dissipation: 65mW; Color: Green; Leds: 1; Published: 03.12.2013; Publisher: Andrew Danich; Part Number: BL-LS0603GC; Value: BL-LS0603GC; Footprint: 0603; Application Category: 1
HL3 = BL-LS0603HC: Type: Индикатор единичный; ID: 13; Forward Voltage: 2.2V; Forward Current: 30mA; Power Dissipation: 65mW; Color: Red; Leds: 1; Published: 03.12.2013; Publisher: Andrew Danich; Part Number: BL-LS0603HC; Value: BL-LS0603HC; Footprint: 0603; Application Category: 1
KT2-KT5 KT7 = TestPoint-SMT: as KT1 on sheet 01_MAIN; Published: 03.03.2015; Publisher: Andrew Danich; Part Number: TestPoint-SMT; Value: TestPoint-SMT; Manufacturer: -; Functional Analog: -
KT6 = 5001: Manufacturer: Keystone Electronics; ID: 2; Value: 5001; Limit Voltage: 100V; Rated Current: 0.5A; Application Type: Miniature THM Test Point; Application Category: 1; Published: 03.03.2015; Publisher: Andrew Danich; Part Number: 5001; Functional Analog: -
L4 = BLM18PG331SN1: as L2 on sheet 01_MAIN; Published: 14.11.2014; Publisher: Andrew Danich; Part Number: BLM18PG331SN1; Value: BLM18PG331SN1; Footprint: 0603; Application Category: 1
L5 = SRP5030T-4R7M: Manufacturer: Bourns; Type: Дроссель; ID: 78; Rated Current: 4.6A; Tolerance: ±20%; Inductance: 4.7uH; DC Resistance: 0.053ohm; Application Category: 1; Working Temperature Min: -40°С; Working Temperature Max: +125°С; Published: 20.05.2010; Publisher: Andrew Danich; Part Number: SRP5030T-4R7M; Value: SRP5030T-4R7M; Footprint: SRP5030T; ClassName: PolyDirectConnect
R27-R30 R32 R37-R39 R45 = RC0603JR-0710KL: as R1 on sheet 01_MAIN; Published: 24.03.2010; Publisher: Andrew Danich; Type: Резистор; Part Number: RC0603JR-0710KL; Footprint: 0603
R31 = RC0603JR-071K5L: Manufacturer: Yageo; ID: 8; Value: 1.5k; Limit Voltage: 50V; Tolerance: ±5%; Temperature Coefficient: 100ppm; Total Power Dissipation: 0.1W; Series Type: Thick-Film; Application Category: 1; Working Temperature Min: -55°С; Working Temperature Max: +155°С; Published: 24.03.2010; Publisher: Andrew Danich; Type: Резистор; Part Number: RC0603JR-071K5L; Footprint: 0603
R33 R34 R51-R53 = RC0603JR-0722RL: Manufacturer: Yageo; ID: 29; Value: 22; Limit Voltage: 50V; Tolerance: ±5%; Temperature Coefficient: 100ppm; Total Power Dissipation: 0.1W; Series Type: Thick-Film; Application Category: 1; Working Temperature Min: -55°С; Working Temperature Max: +155°С; Published: 24.03.2010; Publisher: Andrew Danich; Type: Резистор; Part Number: RC0603JR-0722RL; Footprint: 0603
R35 R43 R44 = RC0603JR-074K7L: Manufacturer: Yageo; ID: 56; Value: 4.7k; Limit Voltage: 50V; Tolerance: ±5%; Temperature Coefficient: 100ppm; Total Power Dissipation: 0.1W; Series Type: Thick-Film; Application Category: 1; Working Temperature Min: -55°С; Working Temperature Max: +155°С; Published: 24.03.2010; Publisher: Andrew Danich; Type: Резистор; Part Number: RC0603JR-074K7L; Footprint: 0603
R36 R42 = RC0603JR-07100R: as R3 on sheet 01_MAIN; Published: 24.03.2010; Publisher: Andrew Danich; Type: Резистор; Part Number: RC0603JR-07100R; Footprint: 0603
R40 = RC0603FR-0763K4L: Manufacturer: Yageo; ID: 468; Value: 63.4k; Limit Voltage: 50V; Tolerance: ±1%; Temperature Coefficient: 100ppm; Total Power Dissipation: 0.1W; Series Type: Thick-Film; Application Category: 1; Working Temperature Min: -55°С; Working Temperature Max: +155°С; Published: 24.03.2010; Publisher: Andrew Danich; Type: Резистор; Part Number: RC0603FR-0763K4L; Footprint: 0603
R41 = RC0603JR-07100KL: Manufacturer: Yageo; ID: 11; Value: 100k; Limit Voltage: 50V; Tolerance: ±5%; Temperature Coefficient: 100ppm; Total Power Dissipation: 0.1W; Series Type: Thick-Film; Application Category: 1; Working Temperature Min: -55°С; Working Temperature Max: +155°С; Functional Analog: CR0603-JW-104E; Published: 24.03.2010; Publisher: Andrew Danich; Type: Резистор; Part Number: RC0603JR-07100KL; Footprint: 0603
R46 R47 = RC0603JR-07330RL: as R4 on sheet 01_MAIN; Published: 24.03.2010; Publisher: Andrew Danich; Type: Резистор; Part Number: RC0603JR-07330RL; Footprint: 0603
R48 = RC0603JR-0720RL: Manufacturer: Yageo; ID: 469; Value: 20; Limit Voltage: 50V; Tolerance: ±5%; Temperature Coefficient: 100ppm; Total Power Dissipation: 0.1W; Series Type: Thick-Film; Application Category: 1; Working Temperature Min: -55°С; Working Temperature Max: +155°С; Published: 24.03.2010; Publisher: Andrew Danich; Type: Резистор; Part Number: RC0603JR-0720RL; Footprint: 0603
R49 = RC0603JR-0733KL: Manufacturer: Yageo; ID: 47; Value: 33k; Limit Voltage: 50V; Tolerance: ±5%; Temperature Coefficient: 100ppm; Total Power Dissipation: 0.1W; Series Type: Thick-Film; Application Category: 1; Working Temperature Min: -55°С; Working Temperature Max: +155°С; Published: 24.03.2010; Publisher: Andrew Danich; Type: Резистор; Part Number: RC0603JR-0733KL; Footprint: 0603
R50 = RC0603JR-076K8L: Manufacturer: Yageo; ID: 71; Value: 6.8k; Limit Voltage: 50V; Tolerance: ±5%; Temperature Coefficient: 100ppm; Total Power Dissipation: 0.1W; Series Type: Thick-Film; Application Category: 1; Working Temperature Min: -55°С; Working Temperature Max: +155°С; Published: 24.03.2010; Publisher: Andrew Danich; Type: Резистор; Part Number: RC0603JR-076K8L; Footprint: 0603
R54 = RC0603JR-0736KL: Manufacturer: Yageo; ID: 49; Value: 36k; Limit Voltage: 50V; Tolerance: ±5%; Temperature Coefficient: 100ppm; Total Power Dissipation: 0.1W; Series Type: Thick-Film; Application Category: 1; Working Temperature Min: -55°С; Working Temperature Max: +155°С; Published: 24.03.2010; Publisher: Andrew Danich; Type: Резистор; Part Number: RC0603JR-0736KL; Footprint: 0603
R55 R56 = RC0603JR-070R: as R2 on sheet 01_MAIN; Published: 24.03.2010; Publisher: Andrew Danich; Type: Резистор; Part Number: RC0603JR-070R; Footprint: 0603
VD1 VD3 = 1N4148WS-7-F: Manufacturer: Diodes Incorporated; Type: Диод; ID: 13; Reverse Voltage: 100V; Reverse Current: 1uA; Forward Voltage: 1V; Forward Current: 150mA; Total Power Dissipation: 200mW; Capacitance: 2pF; Recovery Time: 4nS; Application Category: 1; Working Temperature Min: -55°С; Working Temperature Max: +150°С; Published: 18.05.2010; Publisher: Andrew Danich; Part Number: 1N4148WS-7-F; Value: 1N4148WS-7-F; Functional Analog: 1N4148WS
VD2 = BZX384-C12: Manufacturer: NXP; Type: Стабилитрон; ID: 20; Working Voltage: 12V; Reverse Current: 0.1uA; Forward Voltage: 0.9V; Forward Current: 250mA; Total Power Dissipation: 300mW; Capacitance: 85pF; Differential resistance: 150ohm; Application Category: 1; Working Temperature Min: -65°С; Working Temperature Max: +150°С; Published: 20.05.2013; Publisher: Andrew Danich; Part Number: BZX384-C12; Value: BZX384-C12
VT1 = IRLML9301TRPBF: Manufacturer: International Rectifier; Type: Транзистор; ID: 28; D-S Voltage: -30V; Drain Current: -3.6A; D-S On-Resistance: 0.103omh; Gate Capacitance: 388pF; Total Power Dissipation: 1.3W; Gate Threshold Voltage: -2.4V; Application Category: 1; Working Temperature Min: -55°С; Working Temperature Max: +150°С; Published: 10.02.2014; Publisher: Andrew Danich; Part Number: IRLML9301TRPBF; Value: IRLML9301TRPBF; ClassName: PolyDirectConnect
VT2 VT3 = BC847: Part Number: BC847; Type: Транзистор; ID: 1; Value: BC847; C-E Voltage: 45V; Collector Current: 100mA; C-E Saturation Voltage: 0.6V; DC Current Gain: 110…800; Total Power Dissipation: 250mW; Transition Frequency: 100MHz; Published: 07.05.2013; Publisher: Andrew Danich; Application Category: 1
VT4 = PMC85XP: Manufacturer: NXP Semiconductors; Type: Сборка транзисторная; ID: 33; D-S Voltage: -30V; Drain Current: -3.4A; D-S On-Resistance: 110momh; Gate Capacitance: 680pF; Total Power Dissipation: 1.17W; Gate Threshold Voltage: -1.2V; Application Category: 1; Working Temperature Min: -55°С; Working Temperature Max: +150°С; Published: 13.03.2017; Publisher: Andrew Danich; Part Number: PMC85XP; Value: PMC85XP; Functional Analog: -; ClassName: PolyDirectConnect
XP8 = PLS-5: as XP1 on sheet 01_MAIN; Published: 07.03.2013; Publisher: Andrew Danich; Type: Вилка; Part Number: PLS-5; Pins: 5
XP9 = DJK-02A: Manufacturer: JIA YI; ID: 35; Limit Voltage: 250V; Limit Current: 2A; Connector Type: Male; Resistance: 20mohm; Surface Finish: Bronze; Application Category: 1; Functional Analog: K375A, WTJ-020-04PA; Value: DJK-02A; Published: 07.03.2013; Publisher: Andrew Danich; Type: Вилка; Part Number: DJK-02A; Pins: 3; ClassName: PolyDirectConnect
XS2 = 1981568-1: Manufacturer: TE Connectivity; ID: 30; Limit Voltage: 24V; Limit Current: 1A; Connector Type: Female; Interface: USB 2.0; Max Data Rate: 480 mbps; Application Category: 1; Published: 11.04.2016; Publisher: Andrew Danich; Type: Розетка; Part Number: 1981568-1; Value: 1981568-1; Pins: 9; Mount Type: Surface; ClassName: PolyDirectConnect
ZQ3 = KX-9A 8.0 MHz 30/50/100 16 pF: Manufacturer: Geyer; ID: 12; Output Frequency: 8MHz; Shunt Capacitance: 5pF; Load Capacitance: 16pF; Temperature Coefficient: ±50ppm; Application Category: 1; Working Temperature Min: -20°С; Working Temperature Max: +70°С; Published: 08.03.2013; Publisher: Andrew Danich; Type: Резонатор; Part Number: KX-9A 8.0 MHz 30/50/100 16 pF; Value: KX-9A 8.0 MHz 30/50/100 16 pF; Functional Analog: -

## Nets that join several sheets
GND: 01_MAIN (21 pins), 02_POWER (49 pins)
VCC3P3: 01_MAIN (13 pins), 02_POWER (21 pins)
VCC5P0: 01_MAIN (XP2.5), 02_POWER (14 pins)
VCCIN: 01_MAIN (XP2.8), 02_POWER (10 pins)
nRESET: 01_MAIN (6 pins), 02_POWER (R53.2)
PA6: 01_MAIN (DD1.46 XP1.3 XP6.2), 02_POWER (R52.2)
PA7: 01_MAIN (DD1.47 XP1.2 XP6.3), 02_POWER (R51.2)